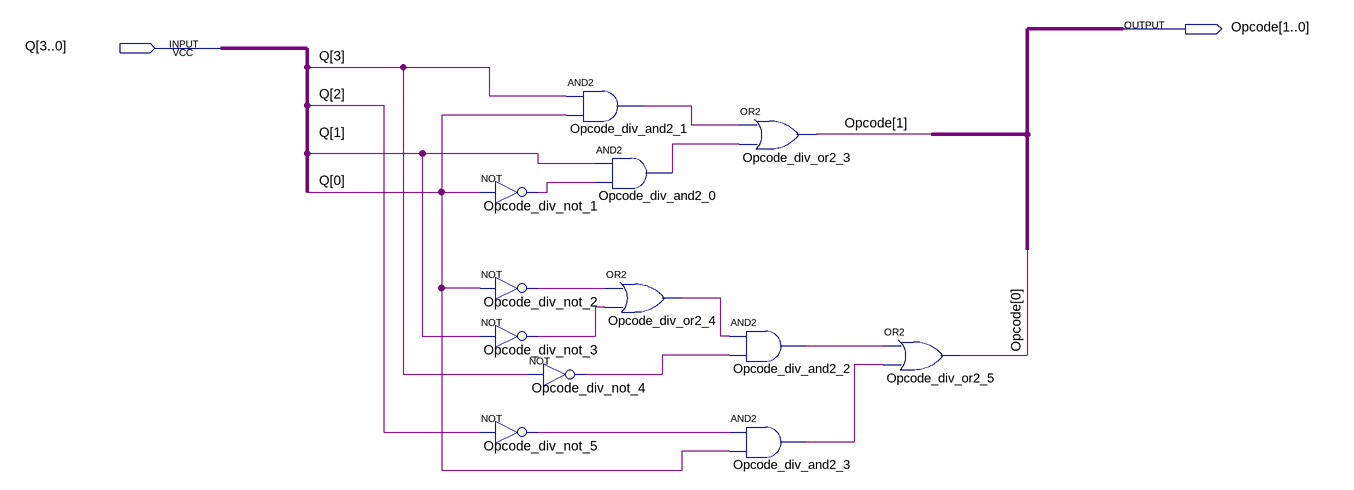
[diagram p0: schematic sheet]
// Quartus schematic Opcode_Division.bdf as structural Verilog: 12 symbols, 2 pins
module Opcode_Division (
  input  [3:0] Q,
  output [1:0] Opcode
);

  wire Opcode_div_and2_0_out, Opcode_div_and2_1_out, Opcode_div_and2_2_out, Opcode_div_and2_3_out,
       Opcode_div_not_1_out, Opcode_div_not_2_out, Opcode_div_not_3_out, Opcode_div_not_4_out,
       Opcode_div_not_5_out, Opcode_div_or2_4_out;

  not Opcode_div_not_1 (Opcode_div_not_1_out, Q[0]);
  not Opcode_div_not_2 (Opcode_div_not_2_out, Q[0]);
  not Opcode_div_not_3 (Opcode_div_not_3_out, Q[1]);
  not Opcode_div_not_4 (Opcode_div_not_4_out, Q[3]);
  not Opcode_div_not_5 (Opcode_div_not_5_out, Q[2]);
  and Opcode_div_and2_1 (Opcode_div_and2_1_out, Q[3], Q[0]);
  and Opcode_div_and2_0 (Opcode_div_and2_0_out, Q[1], Opcode_div_not_1_out);
  or Opcode_div_or2_4 (Opcode_div_or2_4_out, Opcode_div_not_2_out, Opcode_div_not_3_out);
  or Opcode_div_or2_3 (Opcode[1], Opcode_div_and2_1_out, Opcode_div_and2_0_out);
  and Opcode_div_and2_2 (Opcode_div_and2_2_out, Opcode_div_or2_4_out, Opcode_div_not_4_out);
  and Opcode_div_and2_3 (Opcode_div_and2_3_out, Opcode_div_not_5_out, Q[0]);
  or Opcode_div_or2_5 (Opcode[0], Opcode_div_and2_2_out, Opcode_div_and2_3_out);
endmodule
